# Altium schematic sheet CarrierConnector.SchDoc
size A4; Author: T. Kreppel; CompanyName: Technische Universität München; Organization: TUM EAL; Address1: Arcisstraße 21; Address2: 80333 München; Address3: GERMANY; SheetNumber: 2; SheetTotal: 6; CompanyName2: Lehrstuhl für Elektrische Antriebsrechnik u. Leistungselektronik
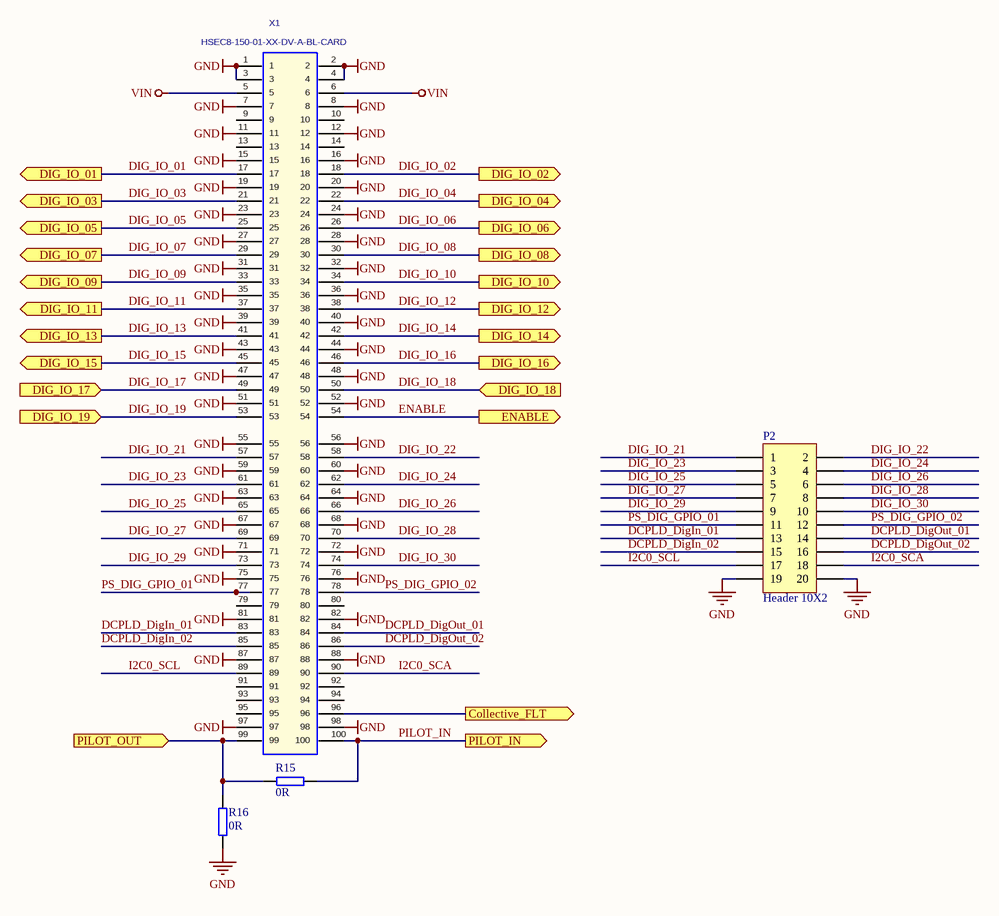
[diagram p0: CarrierConnector.SchDoc]

## Parts
P2  Header 10X2  [HDR2X10]
R15  0R  [R_0603_N]
R16  0R  [R_0603_N]
X1  HSEC8-150-01-XX-DV-A-BL-CARD  [HSEC8-150-01-XX-DV-A-BL-CARD]

## Ports
Collective_FLT (out), DIG_IO_01 (out), DIG_IO_02 (out), DIG_IO_03 (out), DIG_IO_04 (out), DIG_IO_05 (out), DIG_IO_06 (out), DIG_IO_07 (out), DIG_IO_08 (out), DIG_IO_09 (out), DIG_IO_10 (out), DIG_IO_11 (out), DIG_IO_12 (out), DIG_IO_13 (out), DIG_IO_14 (out), DIG_IO_15 (out), DIG_IO_16 (out), DIG_IO_17 (in), DIG_IO_18 (in), DIG_IO_19 (in), ENABLE (out), PILOT_IN (out), PILOT_OUT (in)

## Nets
GND: P2.19 P2.20 R16.1 X1.1 X1.2 X1.3 X1.4 X1.7 X1.8 X1.11 X1.12 X1.15 X1.16 X1.19 X1.20 X1.23 X1.24 X1.27 X1.28 X1.31 X1.32 X1.35 X1.36 X1.39 X1.40 X1.43 X1.44 X1.47 X1.48 X1.51 X1.52 X1.55 X1.56 X1.59 X1.60 X1.63 X1.64 X1.67 X1.68 X1.71 X1.72 X1.75 X1.76 X1.81 X1.82 X1.87 X1.88 X1.97 X1.98
VIN: X1.5 X1.6
Collective_FLT: X1.96 ; port Collective_FLT
DCPLD_DigIn_01: P2.13 X1.83
DCPLD_DigIn_02: P2.15 X1.85
DCPLD_DigOut_01: P2.14 X1.84
DCPLD_DigOut_02: P2.16 X1.86
DIG_IO_01: X1.17 ; port DIG_IO_01
DIG_IO_02: X1.18 ; port DIG_IO_02
DIG_IO_03: X1.21 ; port DIG_IO_03
DIG_IO_04: X1.22 ; port DIG_IO_04
DIG_IO_05: X1.25 ; port DIG_IO_05
DIG_IO_06: X1.26 ; port DIG_IO_06
DIG_IO_07: X1.29 ; port DIG_IO_07
DIG_IO_08: X1.30 ; port DIG_IO_08
DIG_IO_09: X1.33 ; port DIG_IO_09
DIG_IO_10: X1.34 ; port DIG_IO_10
DIG_IO_11: X1.37 ; port DIG_IO_11
DIG_IO_12: X1.38 ; port DIG_IO_12
DIG_IO_13: X1.41 ; port DIG_IO_13
DIG_IO_14: X1.42 ; port DIG_IO_14
DIG_IO_15: X1.45 ; port DIG_IO_15
DIG_IO_16: X1.46 ; port DIG_IO_16
DIG_IO_17: X1.49 ; port DIG_IO_17
DIG_IO_18: X1.50 ; port DIG_IO_18
DIG_IO_19: X1.53 ; port DIG_IO_19
DIG_IO_21: P2.1 X1.57
DIG_IO_22: P2.2 X1.58
DIG_IO_23: P2.3 X1.61
DIG_IO_24: P2.4 X1.62
DIG_IO_25: P2.5 X1.65
DIG_IO_26: P2.6 X1.66
DIG_IO_27: P2.7 X1.69
DIG_IO_28: P2.8 X1.70
DIG_IO_29: P2.9 X1.73
DIG_IO_30: P2.10 X1.74
ENABLE: X1.54 ; port ENABLE
I2C0_SCA: P2.18 X1.90
I2C0_SCL: P2.17 X1.89
PILOT_IN: R15.2 X1.100 ; port PILOT_IN
PILOT_OUT: R15.1 R16.2 X1.99 ; port PILOT_OUT
PS_DIG_GPIO_01: P2.11 X1.77
PS_DIG_GPIO_02: P2.12 X1.78

Not connected (* = marked no-connect by the designer): X1 9 10 13 14 79 80 91 92 93 94 95

## Notes on the sheet
- Title
- Size:
- Date:
- A4
- Revision:
- Time:
- Sheet
- of
- Author:
- Project:

## Library data of the parts
P2 = Header 10X2: Header, 10-Pin, Dual row; LatestRevisionDate: 17-Jul-2002; LatestRevisionNote: Re-released for DXP Platform.; Publisher: Altium Limited
R15 R16 = R_0603: SMD Resistor 0603; MPN: CRCW06030000Z0EBC; Tolerance: 1%; Voltage: 75V; Power: 100 mW; MF: Vishay; Package: 0603; Value: 0R; Created: 2018_09_06_AGeiger; Supplier 1: Mouser; Supplier Part Number 1: 71-CRCW06030000Z0EBC
X1 = HSEC8-150-01-XX-DV-A-BL-CARD: Mating Card Layout for HSEC8-150-01-XX-DV-A-BL; Manufacturer: SAMTEC; Created: 2018_04_23_AGeiger; Value: HSEC8-150-01-XX-DV-A-BL-CARD